# EAGLE design 8k-nolink (EAGLE 9.6.0)
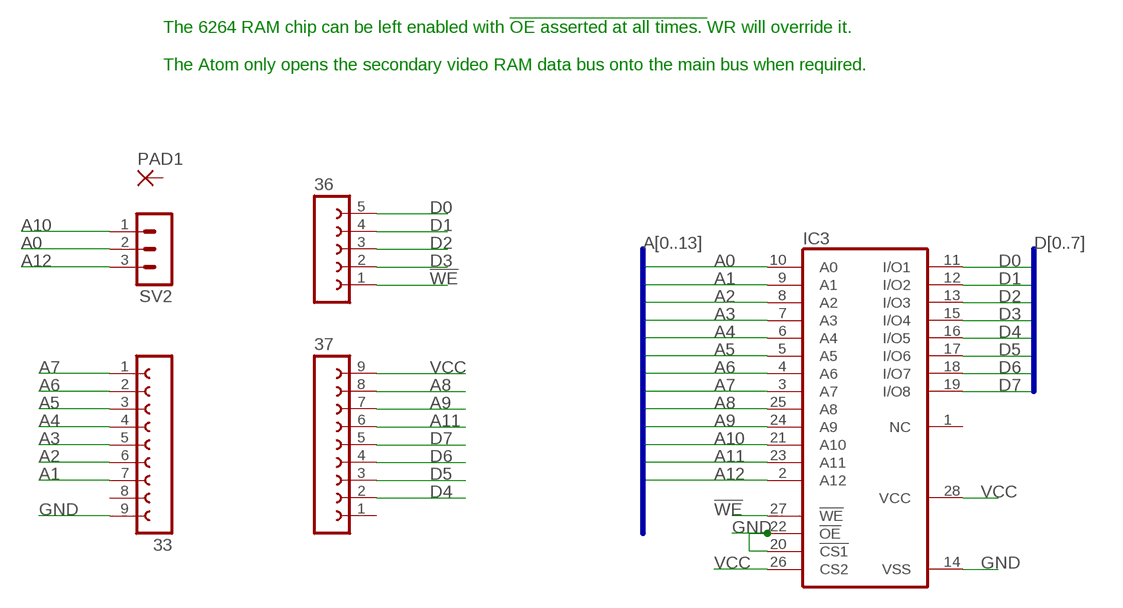
[diagram p0: schematic, sheet 1]

## Parts
33  FE09-1  [FE09]
36  FE05-1  [FE05-1]
37  FE09-1  [FE09]
IC3  6264A  [DIL28-6]
PAD1  1,6/0,8  [1,6/0,8]
SV2  MA03-1  [MA03-1]

## Nets
!WE: 36.1 IC3.27(!WE)
A0: IC3.10(A0) SV2.2
A1: 33.7 IC3.9(A1)
A2: 33.6 IC3.8(A2)
A3: 33.5 IC3.7(A3)
A4: 33.4 IC3.6(A4)
A5: 33.3 IC3.5(A5)
A6: 33.2 IC3.4(A6)
A7: 33.1 IC3.3(A7)
A8: 37.8 IC3.25(A8)
A9: 37.7 IC3.24(A9)
A10: IC3.21(A10) SV2.1
A11: 37.6 IC3.23(A11)
A12: IC3.2(A12) SV2.3
D0: 36.5 IC3.11(I/O1)
D1: 36.4 IC3.12(I/O2)
D2: 36.3 IC3.13(I/O3)
D3: 36.2 IC3.15(I/O4)
D4: 37.2 IC3.16(I/O5)
D5: 37.3 IC3.17(I/O6)
D6: 37.4 IC3.18(I/O7)
D7: 37.5 IC3.19(I/O8)
GND: 33.9 IC3.14(VSS) IC3.20(!CS1) IC3.22(!OE)
VCC: 37.9 IC3.26(CS2) IC3.28(VCC)
Unconnected: 33.8 37.1 IC3.1(NC) PAD1.1(P)

## Buses
A[0..13]
D[0..7]

## Notes on the sheet
- The 6264 RAM chip can be left enabled with !OE asserted at all times. !WR will override it. 
  
  The Atom only opens the secondary video RAM data bus onto the main bus when required.

## Library data of the parts
33 37 = con-lsta:FE09-1: FEMALE HEADER; OC_FARNELL: unknown; OC_NEWARK: unknown
36 = con-lsta:FE05-1: FEMALE HEADER; OC_FARNELL: unknown; OC_NEWARK: unknown
IC3 = memory-hitachi:6264A: MEMORY; OC_FARNELL: 283605; OC_NEWARK: unknown
PAD1 = wirepad:1,6/0,8: THROUGH-HOLE PAD
SV2 = con-lstb:MA03-1: PIN HEADER; OC_FARNELL: unknown; OC_NEWARK: unknown

## Board
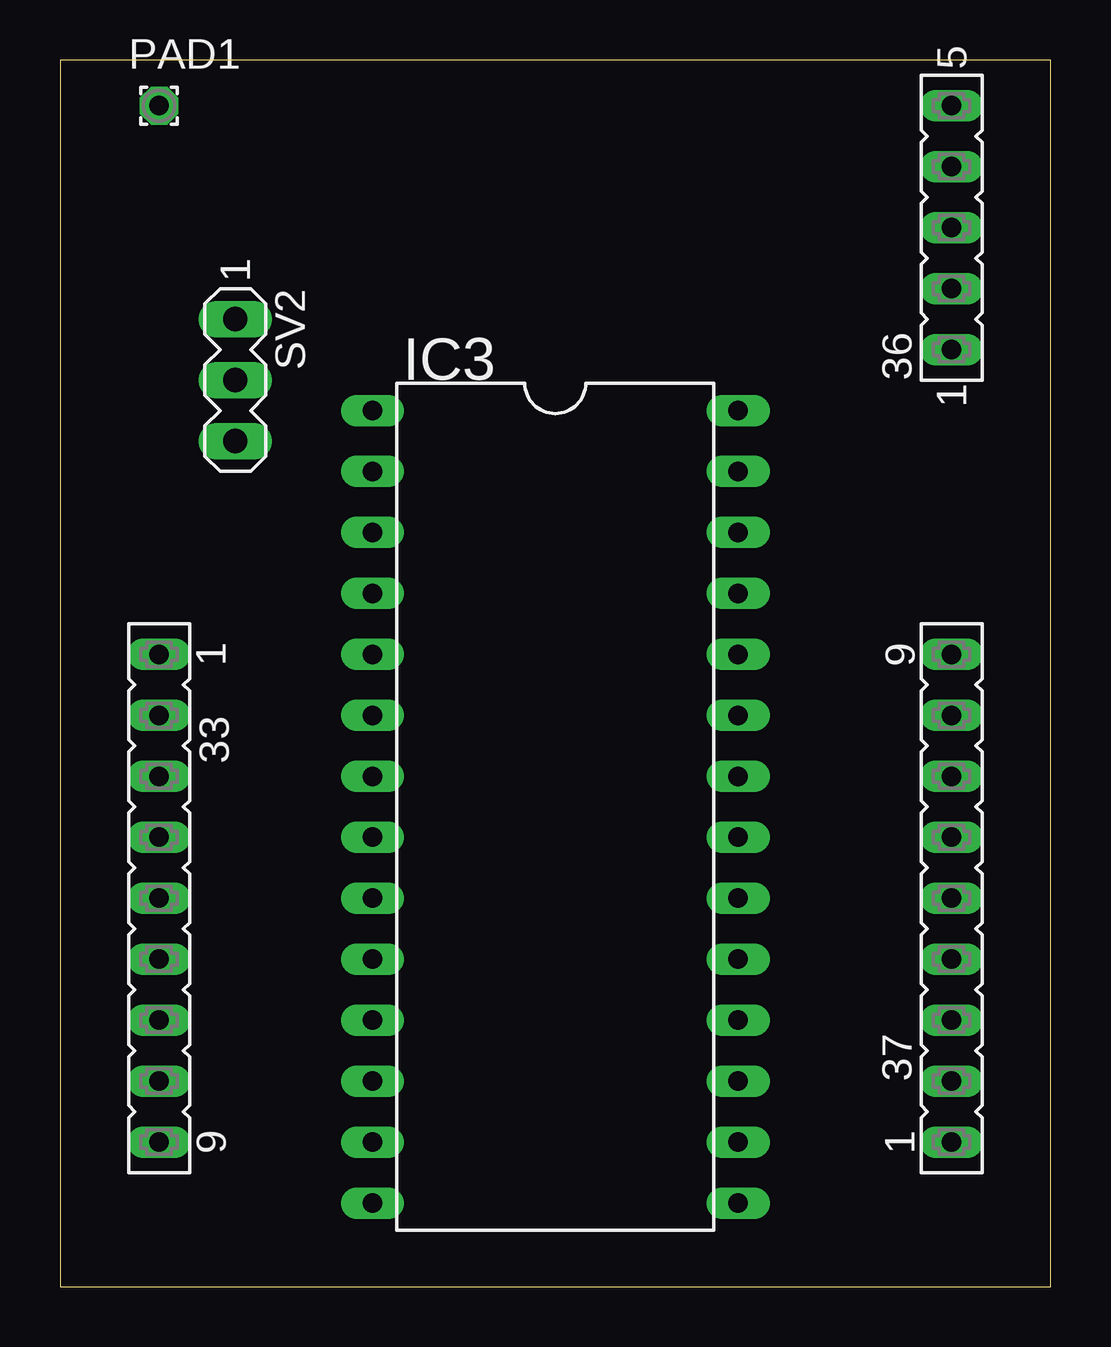
[diagram p1: board, top side]
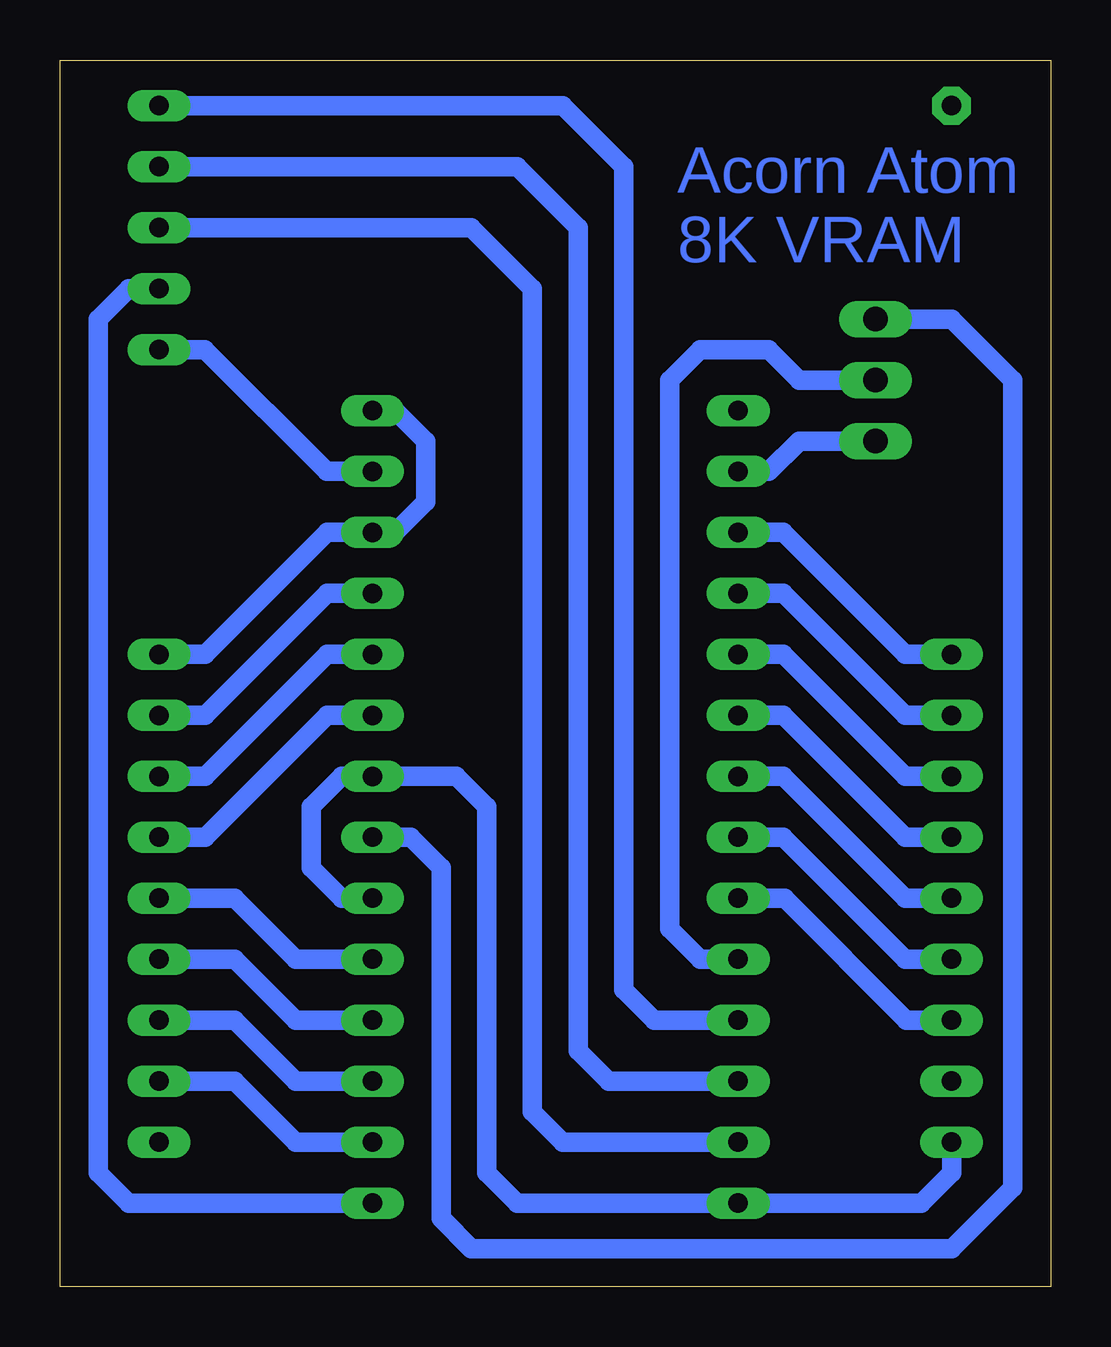
[diagram p2: board, bottom side, seen from below]

Size 41.27 x 51.12 mm. Coordinates in mm from the lower left corner, seen from the top.
Outline: 0,51.12 0,0 41.27,0 41.27,51.12 0,51.12
Copper layers (1*16): Top 0.035mm / dielectric 1.5mm / Bottom 0.035mm
Design rules "default": minimum track width 6mil, minimum drill 0.35mm, track to track 6mil, track to pad 6mil, pad to pad 6mil, via to via 6mil, smd to smd 6mil, copper to edge 40mil, drill to drill 6mil, minimum pad ring 10mil, minimum via ring 8mil, stop-mask expansion 4mil, vias tented up to drill 0mil, thermal gap 10mil

### Footprints (pad centres in the part's own frame; a part is rotated, then mirrored left to right if it is on the bottom)
FE09 = drill 0.813 long: 1 -10.16,0; 2 -7.62,0; 3 -5.08,0; 4 -2.54,0; 5 0,0; 6 2.54,0; 7 5.08,0; 8 7.62,0; 9 10.16,0
FE05-1 = drill 0.813 long: 1 -5.08,0; 2 -2.54,0; 3 0,0; 4 2.54,0; 5 5.08,0
DIL28-6 = drill 0.813 long: 1 -16.51,-7.62; 2 -13.97,-7.62; 3 -11.43,-7.62; 4 -8.89,-7.62; 5 -6.35,-7.62; 6 -3.81,-7.62; 7 -1.27,-7.62; 8 1.27,-7.62; 9 3.81,-7.62; 10 6.35,-7.62; 11 8.89,-7.62; 12 11.43,-7.62; 13 13.97,-7.62; 14 16.51,-7.62; 15 16.51,7.62; 16 13.97,7.62; 17 11.43,7.62; 18 8.89,7.62; 19 6.35,7.62; 20 3.81,7.62; 21 1.27,7.62; 22 -1.27,7.62; 23 -3.81,7.62; 24 -6.35,7.62; 25 -8.89,7.62; 26 -11.43,7.62; 27 -13.97,7.62; 28 -16.51,7.62
1,6/0,8 = drill 0.813 pad 1.6 octagon: 1 0,0
MA03-1 = drill 1.016 long: 1 -2.54,0; 2 0,0; 3 2.54,0

### Placement (x,y rotation side)
33  4.13,16.19 270 top
36  37.15,44.13 90 top
37  37.15,16.19 90 top
IC3  20.64,20 270 top
PAD1  4.13,49.21 0 top
SV2  7.3,37.78 270 top

### Tracks (layer width: path | path; a pad name or v marks a point on that pad's centre or on a via)
!WE
  Bottom 0.813: 36.1 35.24,39.05 30.16,33.97 IC3.27
A0
  Bottom 0.813: IC3.10 14.61,13.65 15.88,14.92 15.88,37.78 14.61,39.05 11.75,39.05 10.48,37.78 SV2.2
A1
  Bottom 0.813: IC3.9 11.09,16.19 6.01,11.11 33.7
A2
  Bottom 0.813: 33.6 6.06,13.65 11.14,18.73 IC3.8
A3
  Bottom 0.813: 33.5 6.06,16.19 11.14,21.27 IC3.7
A4
  Bottom 0.813: 33.4 6.06,18.73 11.14,23.81 IC3.6
A5
  Bottom 0.813: 33.3 6.06,21.27 11.14,26.35 IC3.5
A6
  Bottom 0.813: 33.2 6.06,23.81 11.14,28.89 IC3.4
A7
  Bottom 0.813: 33.1 6.06,26.35 11.14,31.43 IC3.3
A8
  Bottom 0.813: 37.8 35.22,23.81 30.14,28.89 IC3.25
A9
  Bottom 0.813: 37.7 35.22,21.27 30.14,26.35 IC3.24
A10
  Bottom 0.813: IC3.21 26.67,18.73 25.4,17.46 25.4,2.86 24.13,1.59 4.13,1.59 1.59,4.13 1.59,37.78 4.13,40.32 SV2.1
A11
  Bottom 0.813: 37.6 35.22,18.73 30.14,23.81 IC3.23
A12
  Bottom 0.813: IC3.2 11.75,33.97 10.48,35.24 SV2.3
D0
  Bottom 0.813: 36.5 20.32,49.21 17.78,46.67 17.78,12.38 16.51,11.11 IC3.11
D1
  Bottom 0.813: 36.4 22.23,46.67 19.68,44.13 19.68,9.84 18.41,8.57 IC3.12
D2
  Bottom 0.813: 36.3 24.13,44.13 21.59,41.59 21.59,7.3 20.32,6.03 IC3.13
D3
  Bottom 0.813: IC3.15 38.42,3.49 39.69,4.76 39.69,40.32 38.42,41.59 36.2
D4
  Bottom 0.813: IC3.16 31.46,6.03 34,8.57 37.2
D5
  Bottom 0.813: IC3.17 31.46,8.57 34,11.11 37.3
D6
  Bottom 0.813: IC3.18 31.46,11.11 34,13.65 37.4
D7
  Bottom 0.813: IC3.19 31.46,13.65 34,16.19 37.5
GND
  Bottom 0.813: 33.9 4.13,4.76 5.4,3.49 IC3.14 22.23,3.49 23.5,4.76 23.5,20 24.77,21.27 IC3.22 29.53,21.27 30.8,20 30.8,17.46 29.53,16.19 IC3.20
VCC
  Bottom 0.813: IC3.28 27.3,36.51 26.04,35.24 26.04,32.7 27.3,31.43 IC3.26 30.14,31.43 35.22,26.35 37.9

### Text on the board
Bottom: Acorn Atom / 8K VRAM